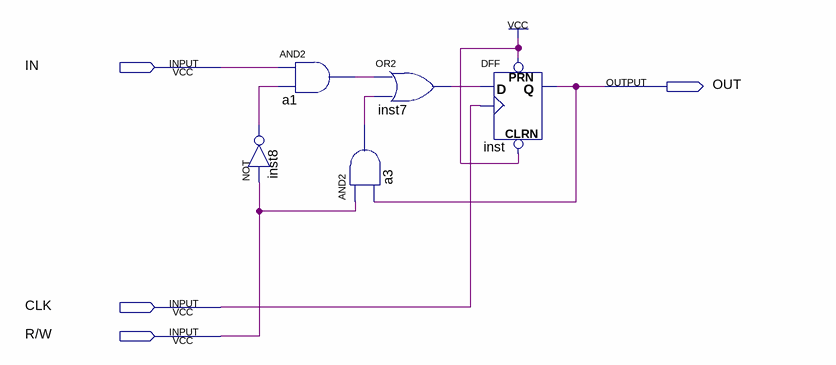
[diagram p0: schematic sheet]
// Quartus schematic CelulaRAM.bdf as structural Verilog: 5 symbols, 4 pins
module CelulaRAM (
  input  IN,
  input  CLK,
  input  \R/W ,
  output OUT
);

  wire a1_out, a3_out, inst7_out, inst8_out;

  not inst8 (inst8_out, \R/W );
  and a1 (a1_out, IN, inst8_out);
  and a3 (a3_out, \R/W , OUT);
  or inst7 (inst7_out, a1_out, a3_out);
  DFF inst (.CLRN(1'b1), .CLK(CLK), .D(inst7_out), .PRN(1'b1), .Q(OUT));
endmodule
